# EAGLE design bcard (EAGLE 6.3)
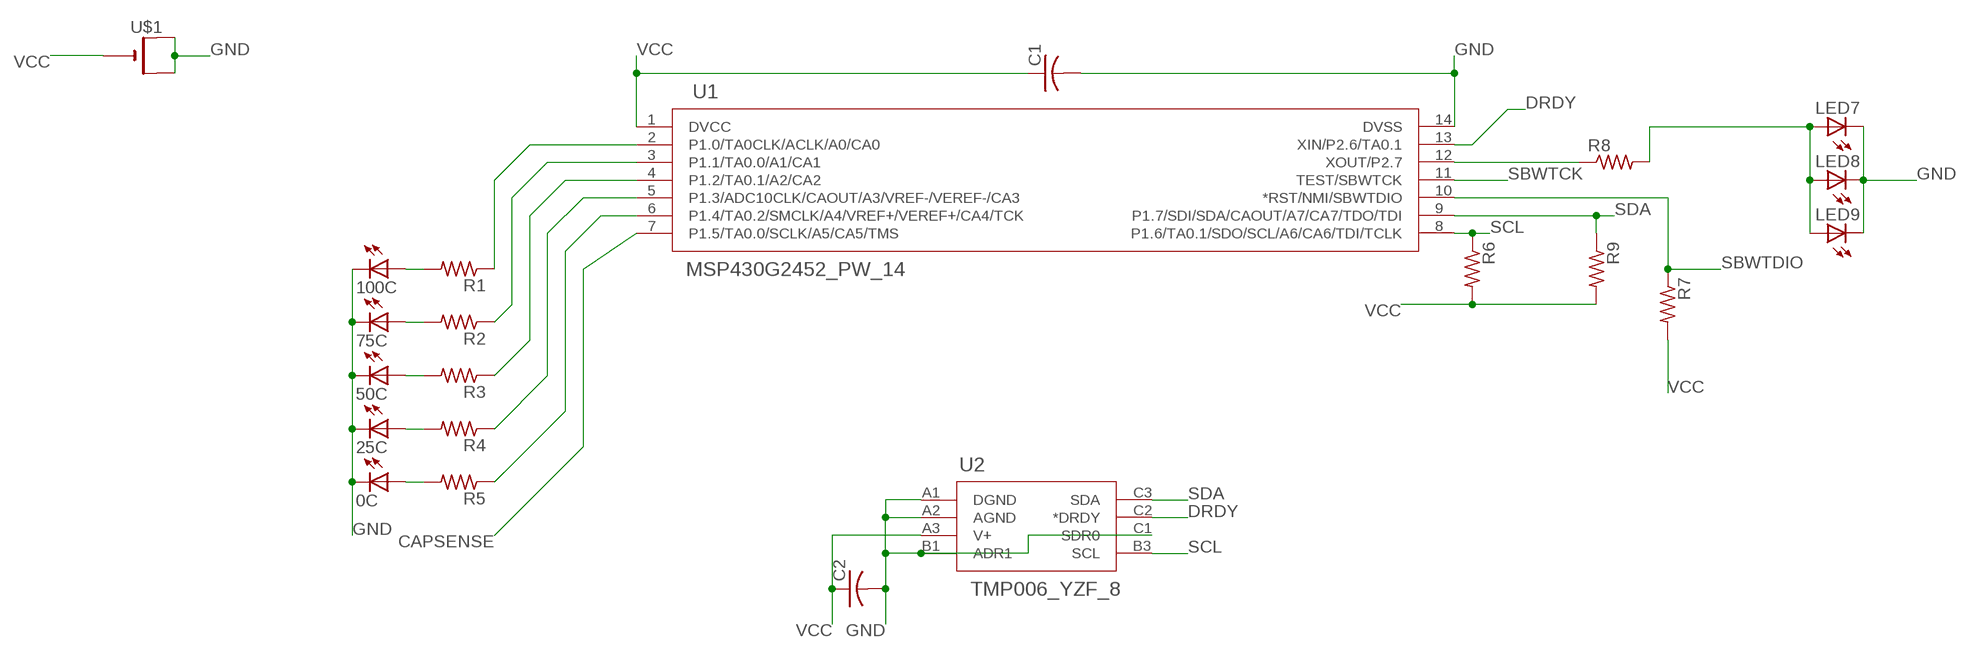
[diagram p0: schematic, sheet 1]

## Parts
0C  LEDCHIP-LED0805  [CHIP-LED0805]
25C  LEDCHIP-LED0805  [CHIP-LED0805]
50C  LEDCHIP-LED0805  [CHIP-LED0805]
75C  LEDCHIP-LED0805  [CHIP-LED0805]
100C  LEDCHIP-LED0805  [CHIP-LED0805]
C1  C-USC0805  [C0805]
C2  C-USC0805  [C0805]
LED7  LEDCHIP-LED0805  [CHIP-LED0805]
LED8  LEDCHIP-LED0805  [CHIP-LED0805]
LED9  LEDCHIP-LED0805  [CHIP-LED0805]
R1  R-US_R0805  [R0805]
R2  R-US_R0805  [R0805]
R3  R-US_R0805  [R0805]
R4  R-US_R0805  [R0805]
R5  R-US_R0805  [R0805]
R6  R-US_R0805  [R0805]
R7  R-US_R0805  [R0805]
R8  R-US_R0805  [R0805]
R9  R-US_R0805  [R0805]
U1  MSP430G2452_PW_14  [PW14]
U2  TMP006_YZF_8  [YZF8]
U$1  CR1220SMT  [CR1220-SMD]

## Nets
CAPSENSE: U1.7(P1.5/TA0.0/SCLK/A5/CA5/TMS)
DRDY: U1.13(XIN/P2.6/TA0.1) U2.C2(*DRDY)
FLASH: R8.1 U1.12(XOUT/P2.7)
FLASHVCC: LED7.A LED8.A LED9.A R8.2
GND: 0C.C 25C.C 50C.C 75C.C 100C.C C1.2 C2.2 LED7.C LED8.C LED9.C U1.14(DVSS) U2.A1(DGND) U2.A2(AGND) U2.B1(ADR1) U2.C1(SDR0) U$1.+$1(+) U$1.+$2(+1)
LED1: R1.1 U1.2(P1.0/TA0CLK/ACLK/A0/CA0)
LED1.1: 100C.A R1.2
LED2: R2.1 U1.3(P1.1/TA0.0/A1/CA1)
LED2.1: 75C.A R2.2
LED3: R3.1 U1.4(P1.2/TA0.1/A2/CA2)
LED3.1: 50C.A R3.2
LED4: R4.1 U1.5(P1.3/ADC10CLK/CAOUT/A3/VREF-/VEREF-/CA3)
LED4.1: 25C.A R4.2
LED5: R5.1 U1.6(P1.4/TA0.2/SMCLK/A4/VREF+/VEREF+/CA4/TCK)
LED5.1: 0C.A R5.2
SBWTCK: U1.11(TEST/SBWTCK)
SBWTDIO: R7.1 U1.10(*RST/NMI/SBWTDIO)
SCL: R6.1 U1.8(P1.6/TA0.1/SDO/SCL/A6/CA6/TDI/TCLK) U2.B3(SCL)
SDA: R9.1 U1.9(P1.7/SDI/SDA/CAOUT/A7/CA7/TDO/TDI) U2.C3(SDA)
VCC: C1.1 C2.1 R6.2 R7.2 R9.2 U1.1(DVCC) U2.A3(V+) U$1.-

## Library data of the parts
0C 25C 50C 75C 100C LED7-LED9 = adafruit:LED: LED OSRAM: - CHIPLED LG R971, LG N971, LY N971, LG Q971, LY Q971, LO R971, LY R971 LH N974, LH R974 LS Q976, LO Q976, LY Q976 LO Q996 - Hyper CHIPLED LW Q18S LB Q993, LB Q99A, LB R99A - SideLED LS A670, LO A670, LY A670, LG A670, LP A670 LB A673, LV A673, LT A673, LW A673 LH A674 LY A675 LS A676, LA A676, LO A676, LY A676, LW A676 LS A679, LY A679, LG A679 - Hyper Micro SIDELED® LS Y876, LA Y876, LO Y876, LY Y876 LT Y87S - SmartLED LW L88C, LW L88S LB L89C, LB L89S, LG L890 LS L89K, LO L89K, LY L89K LS L896, LA L896, LO L896, LY L896 - TOPLED LS T670, LO T670, LY T670, LG T670, LP T670 LSG T670, LSP T670, LSY T670, LOP T670, LYG T670 LG T671, LOG T671, LSG T671 LB T673, LV T673, LT T673, LW T673 LH T674 LS T676, LA T676, LO T676, LY T676, LB T676, LH T676, LSB T676, LW T676 LB T67C, LV T67C, LT T67C, LS T67K, LO T67K, LY T67K, LW E67C LS E67B, LA E67B, LO E67B, LY E67B, LB E67C, LV E67C, LT E67C LW T67C LS T679, LY T679, LG T679 LS T770, LO T770, LY T770, LG T770, LP T770 LB T773, LV T773, LT T773, LW T773 LH T774 LS E675, LA E675, LY E675, LS T675 LS T776, LA T776, LO T776, LY T776, LB T776 LHGB T686 LT T68C, LB T68C - Hyper Mini TOPLED® LB M676 - Mini TOPLED Santana® LG M470 LS M47K, LO M47K, LY M47K Source: http://www.osram.convergy.de/
C1 C2 = adafruit:C-US: CAPACITOR, American symbol
R1-R9 = adafruit:R-US_: RESISTOR, American symbol
U1 = TI:MSP430G2452_PW_14; DATASHEETURL: http://www.ti.com/lit/gpn/MSP430G2452; DESCRIPTION: MSP430G2x52, MSP430G2x12 Mixed Signal Microcontroller; FAMILY_NAME: Value Line; GENERIC_PART_NUMBER: MSP430G2452; INDUSTRY_STD_PKG_TYPE: TSSOP; MANUFACTURER: Texas Instruments; MANUFACTURER_PART_NUMBER: msp430g2452_pw_14; PACKAGE_DESIGNATOR: PW; PIN_COUNT: 14; VENDOR: Texas Instruments
U2 = TI:TMP006_YZF_8; DATASHEETURL: http://www.ti.com/lit/gpn/TMP006; DESCRIPTION: Infrared Thermopile Sensor in Ultra Small Chipscale Package; FAMILY_NAME: TEMPERATURE SENSOR; GENERIC_PART_NUMBER: TMP006; INDUSTRY_STD_PKG_TYPE: DSBGA; MANUFACTURER: Texas Instruments; MANUFACTURER_PART_NUMBER: tmp006_yzf_8; PACKAGE_DESIGNATOR: YZF; PIN_COUNT: 8; VENDOR: Texas Instruments
U$1 = adafruit:CR1220: CR1216/CR1220/CR1225 12mm 3V lithium coin cell Great for battery packup. Both SMT and THM holders. Note the THM package has the ground pads on both sides of the PCB so that the masks are the same - this reduces the cost

## Board
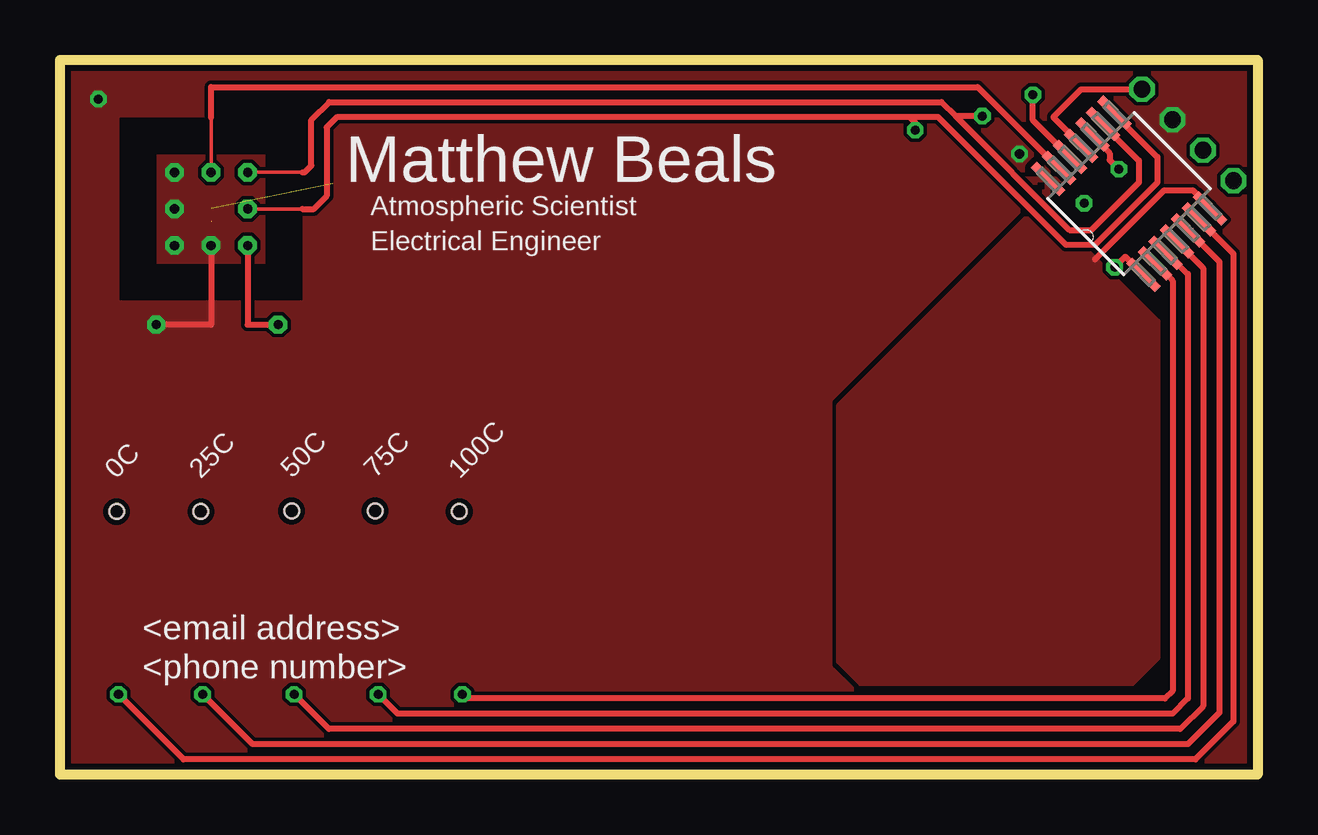
[diagram p1: board, top side]
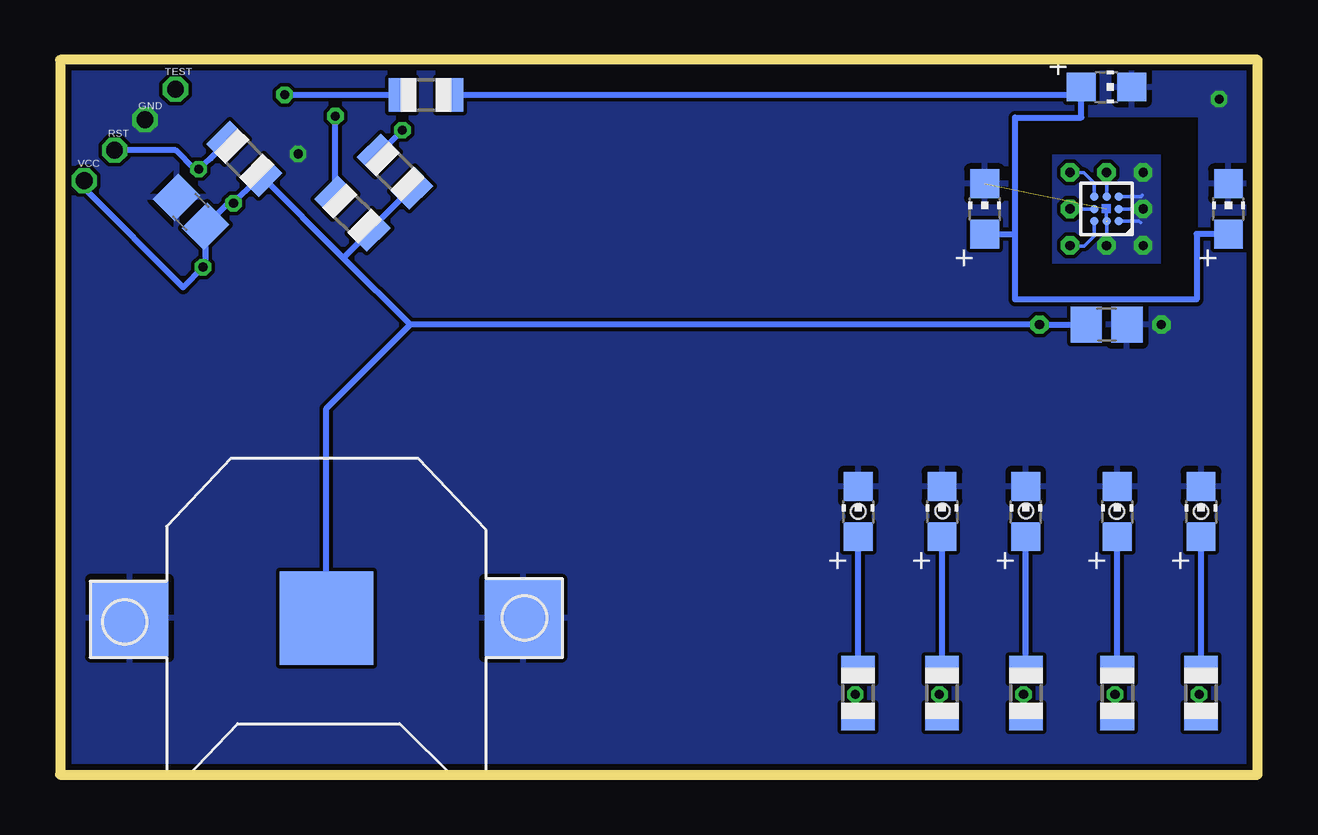
[diagram p2: board, bottom side, seen from below]

Size 49.9 x 29.8 mm. Coordinates in mm from the lower left corner, seen from the top.
Outline: 0,0 0,29.8 49.9,29.8 49.9,0 0,0
Copper layers (1*16): Top 0.035mm / dielectric 1.5mm / Bottom 0.035mm
Design rules "Fusion_eagle_rule_v1.1": minimum track width 6mil, minimum drill 12mil, track to track 6mil, track to pad 6mil, pad to pad 6mil, via to via 6mil, smd to smd 0mil, copper to edge 10mil, drill to drill 10mil, minimum pad ring 10mil, minimum via ring 6mil, stop-mask expansion 2mil, vias tented up to drill 100mil, thermal gap 10mil
Holes 0.6 mm at 2.36,10.97 5.87,10.97 9.65,11 13.13,11 16.64,10.97
tRestrict: area 2.5,25.9 to 10.1,27.4; area 8.6,19.8 to 10.1,25.9; area 2.5,21.3 to 4,25.9; area 2.5,19.8 to 8.6,21.3
bRestrict: area 2.5,25.9 to 10.1,27.4; area 8.6,21.3 to 10.1,25.9; area 2.5,21.3 to 4,25.9; area 2.5,19.8 to 8.6,21.3; area 8.6,19.8 to 10.1,21.3; area 5.2,22.5 to 7.4,24.7

### Footprints (pad centres in the part's own frame; a part is rotated, then mirrored left to right if it is on the bottom)
CHIP-LED0805 = smd 1.2 x 1.2: A 0,-1.05; C 0,1.05
C0805 = smd 1.3 x 1.5: 1 -0.85,0; 2 0.85,0
R0805 = smd 1.1 x 1.4: 1 -1,0; 2 1,0
PW14 = smd 1.676 x 0.356: 1 -2.819,1.956; 2 -2.819,1.295; 3 -2.819,0.66; 4 -2.819,0; 5 -2.819,-0.66; 6 -2.819,-1.295; 7 -2.819,-1.956; 8 2.819,-1.956; 9 2.819,-1.295; 10 2.819,-0.66; 11 2.819,0; 12 2.819,0.66; 13 2.819,1.295; 14 2.819,1.956
YZF8 = smd 0.356 x 0.356: A1 -0.508,0.508; A2 0,0.508; A3 0.508,0.508; B1 -0.508,0; B3 0.508,0; C1 -0.508,-0.508; C2 0,-0.508; C3 0.508,-0.508
CR1220-SMD = smd 3.2 x 3.2: +$1 -8.2,0; +$2 8.2,0 | smd 3.9 x 3.9: - 0,0

### Placement (x,y rotation side)
0C  2.35,10.97 0 bottom
25C  5.85,10.97 0 bottom
50C  9.66,10.97 0 bottom
75C  13.15,10.97 0 bottom
100C  16.64,10.97 0 bottom
C1  6.29,18.77 0 bottom
C2  44.44,23.47 135 bottom
LED7  6.29,28.67 270 bottom
LED8  1.21,23.59 0 bottom
LED9  11.37,23.59 0 bottom
R1  16.64,3.41 90 bottom
R2  13.15,3.41 90 bottom
R3  9.66,3.41 90 bottom
R4  5.85,3.41 90 bottom
R5  2.35,3.41 90 bottom
R6  35.94,25.15 315 bottom
R7  42.23,25.68 315 bottom
R8  34.65,28.35 0 bottom
R9  37.72,23.39 315 bottom
U1  44.54,24.23 135 top
U2  6.29,23.59 180 bottom
U$1  38.8,6.53 180 bottom

### Tracks (layer width: path | path; a pad name or v marks a point on that pad's centre or on a via)
CAPSENSE
  Top 0.254: U1.7 47.92,23.71 47.87,23.71 47.22,24.36 46,24.36 43.13,21.49
  pour Top: 45.72,6.55 45.72,4.88 44.65,3.81 33.53,3.81 33.38,3.81 32.46,4.72 32.46,15.39 40.39,23.32 41.3,23.32 45.72,18.9
DRDY  (via drill 0.38 pad 0.76)
  Top 0.152: v6.29,25.11 6.29,27.4
  Top 0.254: 6.29,27.4 6.29,28.67 38.23,28.67 41.6,25.3 U1.13
  Bottom 0.152: U2.C2 v6.29,25.11
FLASH  (via drill 0.38)
  Top 0.254: U1.12 42.06,25.75 40.54,27.28 v40.54,28.35
  Bottom 0.254: v40.54,28.35 R8.1
FLASHVCC
  Bottom 0.254: LED8.A 2.54,22.54 2.54,19.81 10.1,19.81 10.1,22.54 | LED9.A 10.1,22.54 | 10.1,22.54 10.1,27.4 7.34,27.4 LED7.A 7.67,28.35 R8.2
GND  (via drill 0.38, 0.38 pad 0.76, 0.7)  (2 unrouted)
  Top 0.254: v6.29,22.07 6.29,18.77 v4.01,18.77
  Bottom 0.152: U2.C1 4.86,24.1 4.8,24.16 | U2.B1 v4.77,23.59 | U2.A1 4.95,23.08 4.88,23.01 | U2.A2 v6.29,22.07 | 6.3,23.6 6.3,23.06
  other vias: 4.77,25.12 4.77,22.07 1.6,28.17 39.98,25.88 46.35,27.3
  pour Bottom: 4.26,25.88 8.33,25.88 arc-90 8.58,25.62 8.58,21.56 arc-90 8.33,21.31 4.26,21.31 arc-90 4.01,21.56 4.01,25.62 arc-90
  pour Top (rank 2): 0,30.02 49.99,30.02 49.99,0 0,0 0,6.4
  pour Bottom: 0,30.02 0,0 49.83,0 49.83,29.87
LED1  (via drill 0.38)
  Top 0.254: U1.2 45.67,21.32 45.67,21.28 46.35,20.6 46.35,3.49 46.04,3.17 16.94,3.17 v16.76,3.35
  Bottom 0.254: v16.76,3.35 16.76,2.53 R1.1
LED1.1
  Bottom 0.254: R1.2 100C.A
LED2  (via drill 0.38)
  Top 0.254: U1.3 46.18,21.77 46.18,21.61 46.26,21.61 46.99,20.88 46.99,3.17 46.35,2.54 14.07,2.54 v13.26,3.35
  Bottom 0.254: v13.26,3.35 13.26,2.52 R2.1
LED2.1
  Bottom 0.254: R2.2 75C.A
LED3  (via drill 0.38)
  Top 0.254: U1.4 46.66,22.23 46.66,22.09 47.62,21.13 47.62,2.86 46.67,1.91 11.2,1.91 v9.75,3.35
  Bottom 0.254: v9.75,3.35 9.75,2.5 R3.1
LED3.1
  Bottom 0.254: R3.2 50C.A
LED4  (via drill 0.38)
  Top 0.254: U1.5 47.15,22.7 47.15,22.55 48.31,21.39 48.31,2.59 46.99,1.27 8.03,1.27 v5.94,3.35
  Bottom 0.254: v5.94,3.35 5.94,2.5 R4.1
LED4.1
  Bottom 0.254: R4.2 25C.A
LED5  (via drill 0.38)
  Top 0.254: U1.6 47.45,23.03 47.58,23.03 48.9,21.72 48.9,2.22 47.31,0.64 5.16,0.64 v2.44,3.35
  Bottom 0.254: v2.44,3.35 2.44,2.49 R5.1
LED5.1
  Bottom 0.254: R5.2 0C.A
SBWTCK  (via drill 0.7)
  Top 0.254: U1.11 42.55,26.25 41.4,27.39 41.4,27.43 42.55,28.57 v45.09,28.57
SBWTDIO  (via drill 0.38, 0.7)
  Top 0.254: U1.10 43.02,26.63 43.74,25.91 43.74,25.63 v44.12,25.25
  Bottom 0.254: R7.1 43.61,25.7 v44.12,25.25 44.3,25.25 45.09,26.04 v47.62,26.04
SCL  (via drill 0.38, 0.38 pad 0.76)
  Top 0.152: v7.82,23.59 10.1,23.59
  Top 0.254: U1.8 43.93,27.54 45.72,25.76 45.72,24.69 43.13,22.1 41.91,22.1 36.58,27.43 35.38,27.43 | 35.38,27.43 11.56,27.43 11.11,26.99 11.11,24.13 10.57,23.59 10.1,23.59 | v35.64,26.87 35.64,27.18 35.38,27.43
  Bottom 0.152: U2.B3 v7.82,23.59
  Bottom 0.254: R6.1 36.65,25.86 v35.64,26.87
SDA  (via drill 0.38, 0.38 pad 0.76)
  Top 0.152: v7.82,25.11 10.1,25.11
  Top 0.254: U1.9 43.47,27.25 43.43,27.28 43.43,27.13 44.96,25.6 44.96,24.69 42.98,22.71 42.06,22.71 37.31,27.46 | 37.31,27.46 36.73,28.04 11.21,28.04 10.48,27.3 10.48,25.4 10.19,25.11 10.1,25.11 | v38.43,27.46 37.31,27.46
  Bottom 0.152: U2.C3 6.8,24.66 7.24,25.09 7.8,25.09 v7.82,25.11
  Bottom 0.254: R9.1 v38.43,27.45 v38.43,27.46
VCC  (via drill 0.38, 0.38 pad 0.76, 0.7)
  Top 0.254: v7.82,22.07 7.82,18.77 v9.09,18.77 | 45.19,20.85 U1.1 44.4,21.59 44.37,21.59 v43.94,21.16
  Bottom 0.152: U2.A3 6.8,22.46 7.21,22.05 7.8,22.05 v7.82,22.07
  Bottom 0.254: C1.1 v9.09,18.77 35.31,18.77 | 35.31,18.77 38.09,21.55 | 38.09,21.55 R7.2 41.72,24.77 v42.67,23.82 42.88,23.82 C2.1 43.84,21.26 v43.94,21.16 44.77,20.33 44.77,20.32 48.9,24.45 v48.9,24.77 | U$1.- 38.8,15.28 35.31,18.77 | R6.2 35.26,24.44 R9.2 37.01,22.63 38.09,21.55
(copper drawn outside any net)
  shapes: Bottom area x1

### Text on the board
_tsilk: Matthew Beals | Atmospheric Scientist | Electrical Engineer | <email address> | <phone number>
_bsilk: TEST | GND | RST | VCC